# Altium schematic sheet PCI Express_24130X11115_164PIN.schdoc: PCI Express x16 Top Sheet
size A4; SheetNumber: 1; SheetTotal: 2
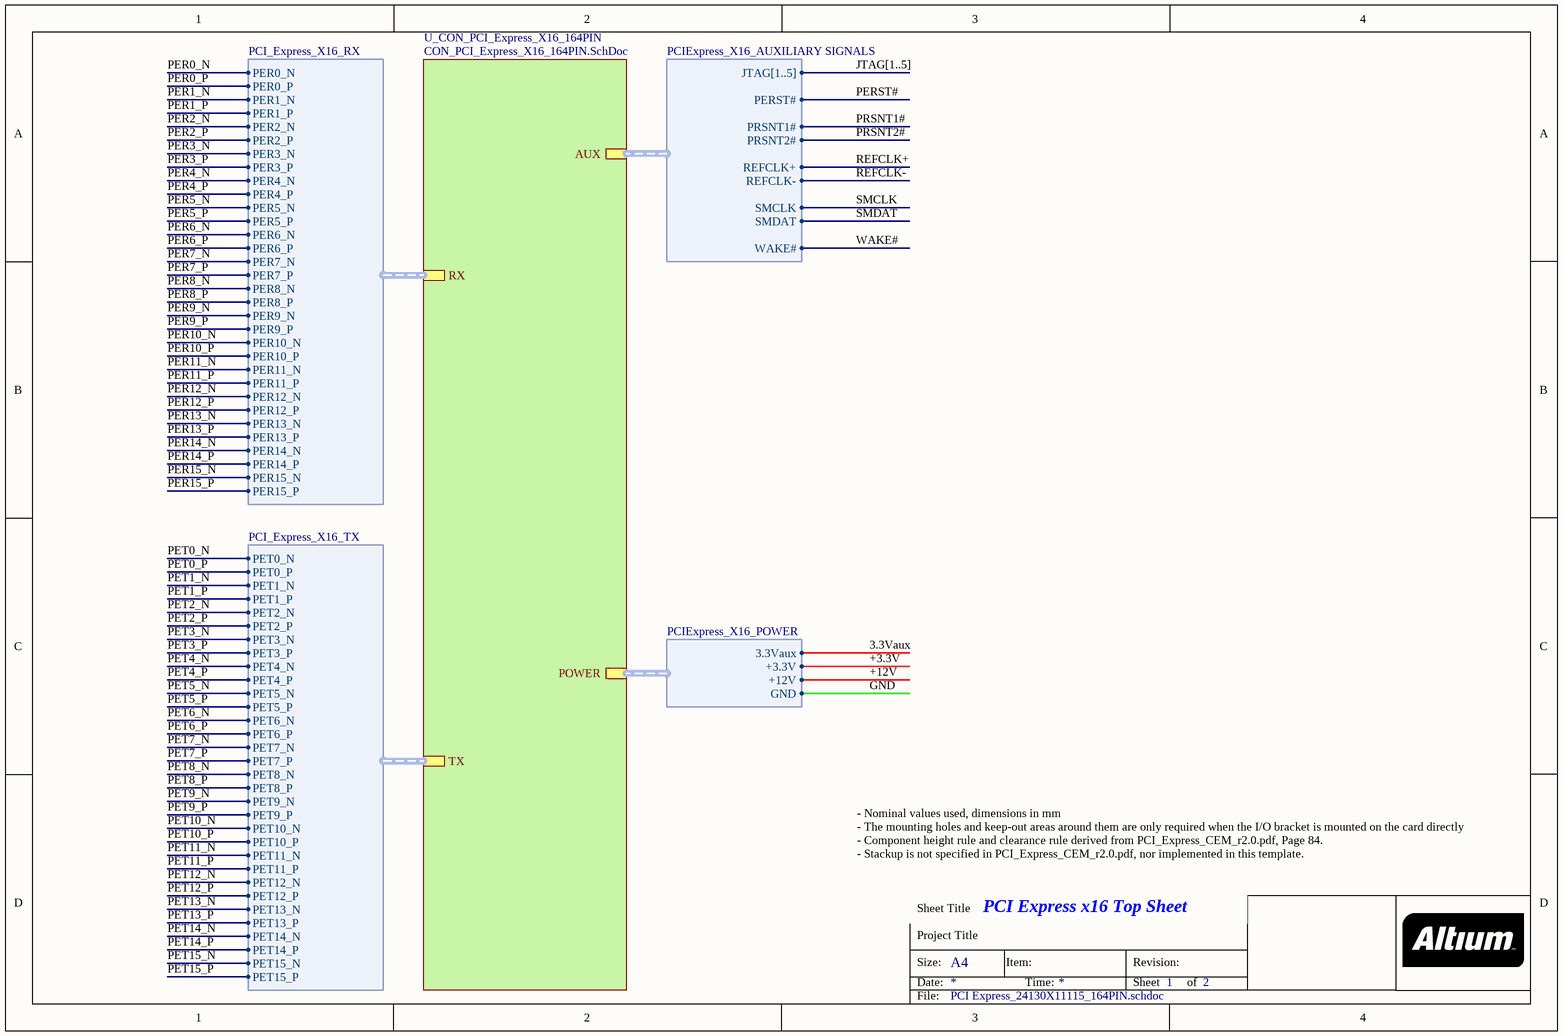
[diagram p0: PCI Express_24130X11115_164PIN.schdoc]

## Sub-sheets
U_CON_PCI_Express_X16_164PIN = CON_PCI_Express_X16_164PIN.SchDoc: POWER (harness PCIExpress_X16_POWER), AUX (harness PCIExpress_X16_AUXILIARY SIGNALS), TX (harness PCI_Express_X16_TX), RX (harness PCI_Express_X16_RX)

## Harnesses
PCI_Express_X16_RX: PER0_N, PER0_P, PER1_N, PER1_P, PER2_N, PER2_P, PER3_N, PER3_P, PER4_N, PER4_P, PER5_N, PER5_P, PER6_N, PER6_P, PER7_N, PER7_P, PER8_N, PER8_P, PER9_N, PER9_P, PER10_N, PER10_P, PER11_N, PER11_P, PER12_N, PER12_P, PER13_N, PER13_P, PER14_N, PER14_P, PER15_N, PER15_P
PCI_Express_X16_TX: PET0_N, PET0_P, PET1_N, PET1_P, PET2_N, PET2_P, PET3_N, PET3_P, PET4_N, PET4_P, PET5_N, PET5_P, PET6_N, PET6_P, PET7_N, PET7_P, PET8_N, PET8_P, PET9_N, PET9_P, PET10_N, PET10_P, PET11_N, PET11_P, PET12_N, PET12_P, PET13_N, PET13_P, PET14_N, PET14_P, PET15_N, PET15_P
PCIExpress_X16_POWER: +3.3V, +12V, GND, 3.3Vaux
PCIExpress_X16_AUXILIARY SIGNALS: JTAG[1..5], PERST#, PRSNT1#, PRSNT2#, REFCLK+, REFCLK-, SMCLK, SMDAT, WAKE#

## Nets
3.3Vaux: sheet U_CON_PCI_Express_X16_164PIN/POWER.3.3Vaux
+3.3V: sheet U_CON_PCI_Express_X16_164PIN/POWER.+3.3V
+12V: sheet U_CON_PCI_Express_X16_164PIN/POWER.+12V
GND: sheet U_CON_PCI_Express_X16_164PIN/POWER.GND
PER0_N: sheet U_CON_PCI_Express_X16_164PIN/RX.PER0_N
PER0_P: sheet U_CON_PCI_Express_X16_164PIN/RX.PER0_P
PER1_N: sheet U_CON_PCI_Express_X16_164PIN/RX.PER1_N
PER1_P: sheet U_CON_PCI_Express_X16_164PIN/RX.PER1_P
PER2_N: sheet U_CON_PCI_Express_X16_164PIN/RX.PER2_N
PER2_P: sheet U_CON_PCI_Express_X16_164PIN/RX.PER2_P
PER3_N: sheet U_CON_PCI_Express_X16_164PIN/RX.PER3_N
PER3_P: sheet U_CON_PCI_Express_X16_164PIN/RX.PER3_P
PER4_N: sheet U_CON_PCI_Express_X16_164PIN/RX.PER4_N
PER4_P: sheet U_CON_PCI_Express_X16_164PIN/RX.PER4_P
PER5_N: sheet U_CON_PCI_Express_X16_164PIN/RX.PER5_N
PER5_P: sheet U_CON_PCI_Express_X16_164PIN/RX.PER5_P
PER6_N: sheet U_CON_PCI_Express_X16_164PIN/RX.PER6_N
PER6_P: sheet U_CON_PCI_Express_X16_164PIN/RX.PER6_P
PER7_N: sheet U_CON_PCI_Express_X16_164PIN/RX.PER7_N
PER7_P: sheet U_CON_PCI_Express_X16_164PIN/RX.PER7_P
PER8_N: sheet U_CON_PCI_Express_X16_164PIN/RX.PER8_N
PER8_P: sheet U_CON_PCI_Express_X16_164PIN/RX.PER8_P
PER9_N: sheet U_CON_PCI_Express_X16_164PIN/RX.PER9_N
PER9_P: sheet U_CON_PCI_Express_X16_164PIN/RX.PER9_P
PER10_N: sheet U_CON_PCI_Express_X16_164PIN/RX.PER10_N
PER10_P: sheet U_CON_PCI_Express_X16_164PIN/RX.PER10_P
PER11_N: sheet U_CON_PCI_Express_X16_164PIN/RX.PER11_N
PER11_P: sheet U_CON_PCI_Express_X16_164PIN/RX.PER11_P
PER12_N: sheet U_CON_PCI_Express_X16_164PIN/RX.PER12_N
PER12_P: sheet U_CON_PCI_Express_X16_164PIN/RX.PER12_P
PER13_N: sheet U_CON_PCI_Express_X16_164PIN/RX.PER13_N
PER13_P: sheet U_CON_PCI_Express_X16_164PIN/RX.PER13_P
PER14_N: sheet U_CON_PCI_Express_X16_164PIN/RX.PER14_N
PER14_P: sheet U_CON_PCI_Express_X16_164PIN/RX.PER14_P
PER15_N: sheet U_CON_PCI_Express_X16_164PIN/RX.PER15_N
PER15_P: sheet U_CON_PCI_Express_X16_164PIN/RX.PER15_P
PERST#: sheet U_CON_PCI_Express_X16_164PIN/AUX.PERST#
PET0_N: sheet U_CON_PCI_Express_X16_164PIN/TX.PET0_N
PET0_P: sheet U_CON_PCI_Express_X16_164PIN/TX.PET0_P
PET1_N: sheet U_CON_PCI_Express_X16_164PIN/TX.PET1_N
PET1_P: sheet U_CON_PCI_Express_X16_164PIN/TX.PET1_P
PET2_N: sheet U_CON_PCI_Express_X16_164PIN/TX.PET2_N
PET2_P: sheet U_CON_PCI_Express_X16_164PIN/TX.PET2_P
PET3_N: sheet U_CON_PCI_Express_X16_164PIN/TX.PET3_N
PET3_P: sheet U_CON_PCI_Express_X16_164PIN/TX.PET3_P
PET4_N: sheet U_CON_PCI_Express_X16_164PIN/TX.PET4_N
PET4_P: sheet U_CON_PCI_Express_X16_164PIN/TX.PET4_P
PET5_N: sheet U_CON_PCI_Express_X16_164PIN/TX.PET5_N
PET5_P: sheet U_CON_PCI_Express_X16_164PIN/TX.PET5_P
PET6_N: sheet U_CON_PCI_Express_X16_164PIN/TX.PET6_N
PET6_P: sheet U_CON_PCI_Express_X16_164PIN/TX.PET6_P
PET7_N: sheet U_CON_PCI_Express_X16_164PIN/TX.PET7_N
PET7_P: sheet U_CON_PCI_Express_X16_164PIN/TX.PET7_P
PET8_N: sheet U_CON_PCI_Express_X16_164PIN/TX.PET8_N
PET8_P: sheet U_CON_PCI_Express_X16_164PIN/TX.PET8_P
PET9_N: sheet U_CON_PCI_Express_X16_164PIN/TX.PET9_N
PET9_P: sheet U_CON_PCI_Express_X16_164PIN/TX.PET9_P
PET10_N: sheet U_CON_PCI_Express_X16_164PIN/TX.PET10_N
PET10_P: sheet U_CON_PCI_Express_X16_164PIN/TX.PET10_P
PET11_N: sheet U_CON_PCI_Express_X16_164PIN/TX.PET11_N
PET11_P: sheet U_CON_PCI_Express_X16_164PIN/TX.PET11_P
PET12_N: sheet U_CON_PCI_Express_X16_164PIN/TX.PET12_N
PET12_P: sheet U_CON_PCI_Express_X16_164PIN/TX.PET12_P
PET13_N: sheet U_CON_PCI_Express_X16_164PIN/TX.PET13_N
PET13_P: sheet U_CON_PCI_Express_X16_164PIN/TX.PET13_P
PET14_N: sheet U_CON_PCI_Express_X16_164PIN/TX.PET14_N
PET14_P: sheet U_CON_PCI_Express_X16_164PIN/TX.PET14_P
PET15_N: sheet U_CON_PCI_Express_X16_164PIN/TX.PET15_N
PET15_P: sheet U_CON_PCI_Express_X16_164PIN/TX.PET15_P
PRSNT1#: sheet U_CON_PCI_Express_X16_164PIN/AUX.PRSNT1#
PRSNT2#: sheet U_CON_PCI_Express_X16_164PIN/AUX.PRSNT2#
REFCLK+: sheet U_CON_PCI_Express_X16_164PIN/AUX.REFCLK+
REFCLK-: sheet U_CON_PCI_Express_X16_164PIN/AUX.REFCLK-
SMCLK: sheet U_CON_PCI_Express_X16_164PIN/AUX.SMCLK
SMDAT: sheet U_CON_PCI_Express_X16_164PIN/AUX.SMDAT
WAKE#: sheet U_CON_PCI_Express_X16_164PIN/AUX.WAKE#

## Buses and harness runs
bus JTAG[1..5]

## Notes on the sheet
- - Nominal values used, dimensions in mm
  - The mounting holes and keep-out areas around them are only required when the I/O bracket is mounted on the card directly
  - Component height rule and clearance rule derived from PCI_Express_CEM_r2.0.pdf, Page 84.
  - Stackup is not specified in PCI_Express_CEM_r2.0.pdf, nor implemented in this template.
- Sheet Title
- Project Title
- Size:
- Date:
- A4
- Item:
- Time:
- Revision:
- Sheet
- of
- File: